# Altium schematic sheet Carte_Alim_2019_TOP.SchDoc
size A4; Author: Audran; CompanyName: Goldorak; Address1: Electrolab; Address2: 52 rue Paul Lescop; Address3: 92000 Nanterre; DocumentNumber: 1; SheetNumber: 1; SheetTotal: 5; ProjectName: Cartes_2017
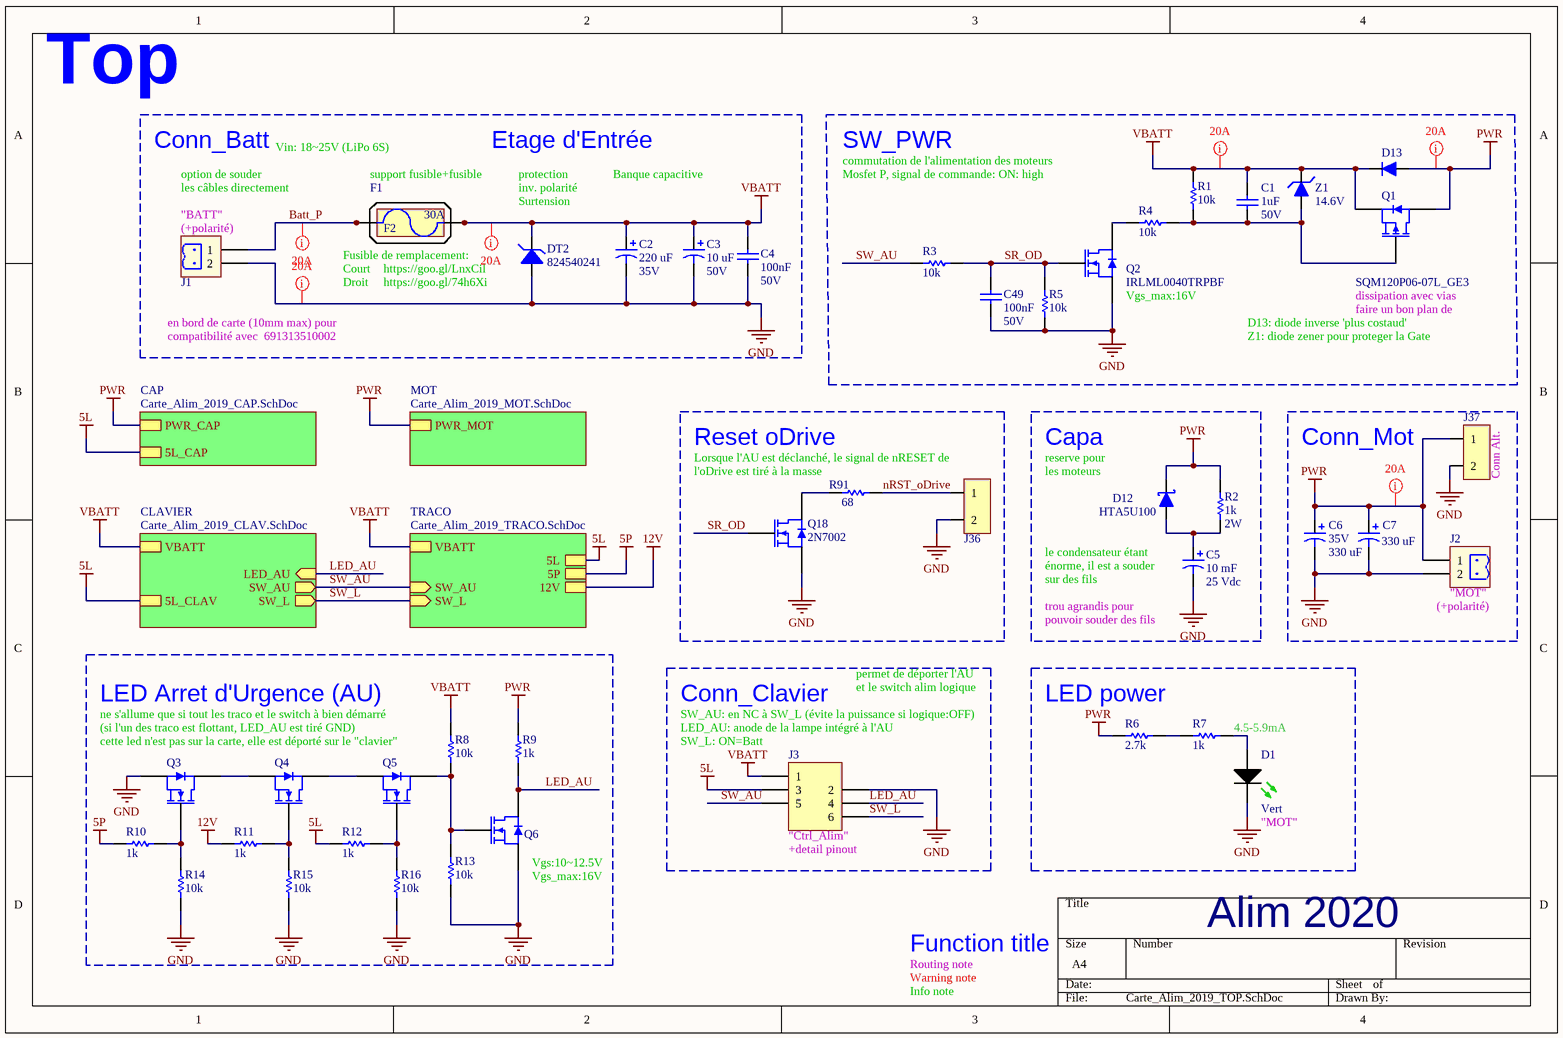
[diagram p0: Carte_Alim_2019_TOP.SchDoc]

## Parts
C1  1uF  RatedVoltage: 50V  [WCAP-CSGP_0805, 2x1.25x1.25]
C2  220 uF  RatedVoltage: 35V  [WCAP-ATG8_8x11.5x3.5x0.5]
C3  10 uF  RatedVoltage: 50V  [WCAP-ATG8_5x11x2x0.5]
C4  100nF  RatedVoltage: 50V  [WCAP-CSGP_0603, 1.6x0.8x0.8]
C5  10 mF  Rated Voltage: 25 Vdc  [WCAP-ATG8_22x41x10x0.8]
C6  330 uF  RatedVoltage: 35V  [WCAP-ATG8_10x12.5x5x0.6]
C7  330 uF  [WCAP-ATG8_10x12.5x5x0.6]
C49  100nF  RatedVoltage: 50V  [WCAP-CSGP_0603, 1.6x0.8x0.8]
D1  Vert  [SMCW_0603]
D12  HTA5U100  [SMA Diode (DO-214AC)]
D13  RS3J R6  [DO-214AB_Unidirectional]  (value not drawn)
DT2  824540241  [DO-214AB_Unidirectional]
F1  3557-2  [3557-2]  (value not drawn)
F2  Courant nominal: 30A  (hidden comment: 0891030.NXS)  (mechanical)
J1  691311500102  [691311500102]  (value not drawn)
J2  691311500102  [691311500102]  (value not drawn)
J3  690367280676  [690367280676]  (value not drawn)
J36  22-03-2021  [22-03-2021]  (value not drawn)
J37  22-03-2021  [22-03-2021]  (value not drawn)
Q1  SQM120P06-07L_GE3  [TO-263]
Q2  IRLML0040TRPBF  [SOT-23]
Q3  IRLML0040TRPBF  [SOT-23]  (value not drawn)
Q4  IRLML0040TRPBF  [SOT-23]  (value not drawn)
Q5  IRLML0040TRPBF  [SOT-23]  (value not drawn)
Q6  IRLML0040TRPBF  [SOT-23]  (value not drawn)
Q18  2N7002  [SOT-23]
R1  value 10k  [RESC1608X06N]  (hidden comment: RC0603FR-0710KL)
R2  1k  Power: 2W  [RESADV480W80L1200D390]
R3  value 10k  [RESC1608X06N]  (hidden comment: RC0603FR-0710KL)
R4  value 10k  [RESC1608X06N]  (hidden comment: RC0603FR-0710KL)
R5  value 10k  [RESC1608X06N]  (hidden comment: RC0603FR-0710KL)
R6  value 2.7k  [RESC2012X06M]  (hidden comment: RC0805FR-072K7L)
R7  value 1k  [RESC1608X06N]  (hidden comment: RC0603FR-071KL)
R8  value 10k  [RESC1608X06N]  (hidden comment: RC0603FR-0710KL)
R9  value 1k  [RESC1608X06N]  (hidden comment: RC0603FR-071KL)
R10  value 1k  [RESC1608X06N]  (hidden comment: RC0603FR-071KL)
R11  value 1k  [RESC1608X06N]  (hidden comment: RC0603FR-071KL)
R12  value 1k  [RESC1608X06N]  (hidden comment: RC0603FR-071KL)
R13  value 10k  [RESC1608X06N]  (hidden comment: RC0603FR-0710KL)
R14  value 10k  [RESC1608X06N]  (hidden comment: RC0603FR-0710KL)
R15  value 10k  [RESC1608X06N]  (hidden comment: RC0603FR-0710KL)
R16  value 10k  [RESC1608X06N]  (hidden comment: RC0603FR-0710KL)
R91  value 68  [RESC1608X06N]  (hidden comment: RC0603FR-0768RL)
Z1  value 14.6V  [SOD-323]  (hidden comment: MM3Z15VST1G)

## Blocks framed on the sheet
SW_PWR: C1 C49 D13 Q1 Q2 R1 R3-R5 Z1
Reset oDrive: J36 Q18 R91
Capa: C5 D12 R2
Conn_Mot: C6 C7 J2 J37
LED Arret d'Urgence (AU): Q3-Q6 R8-R16
Conn_Clavier: J3
LED power: D1 R6 R7

## Sub-sheets
CAP = Carte_Alim_2019_CAP.SchDoc: PWR_CAP, 5L_CAP
CLAVIER = Carte_Alim_2019_CLAV.SchDoc: 5L_CLAV, VBATT, SW_L (out), LED_AU (in), SW_AU (out)
MOT = Carte_Alim_2019_MOT.SchDoc: PWR_MOT
TRACO = Carte_Alim_2019_TRACO.SchDoc: VBATT, 5L, 5P, 12V, SW_L (in), SW_AU (in)

## Nets
5L: J3.3 R12.2 ; sheet CAP/5L_CAP, sheet TRACO/5L, sheet CLAVIER/5L_CLAV
5P: R10.2 ; sheet TRACO/5P
12V: R11.2 ; sheet TRACO/12V
GND: C2.2 C3.2 C4.1 C5.2 C6.2 C7.2 C49.1 D1.1(C) DT2.1 J1.2 J2.2 J3.2 J36.2 J37.2 Q2.2(S) Q3.2(S) Q6.2(S) Q18.2(S) R5.2 R13.1 R14.1 R15.1 R16.1
PWR: C6.1 C7.1 D12.2 D13.1 J2.1 J37.1 Q1.4(D) R2.1 R6.1 R9.2 ; sheet CAP/PWR_CAP, sheet MOT/PWR_MOT
VBATT: C1.2 C2.1 C3.1 C4.2 D13.2 DT2.2 F1.2 F1.4 J3.1 Q1.3(S) R1.2 R8.2 Z1.2 ; sheet TRACO/VBATT, sheet CLAVIER/VBATT
Batt_P: F1.1 F1.3 J1.1
LED_AU: J3.4 Q6.3(D) R9.1 ; sheet CLAVIER/LED_AU
nRST_oDrive: J36.1 R91.2
SR_OD: C49.2 Q2.1(G) Q18.1(G) R3.2 R5.1
SW_AU: J3.5 R3.1 ; sheet TRACO/SW_AU, sheet CLAVIER/SW_AU
SW_L: J3.6 ; sheet TRACO/SW_L, sheet CLAVIER/SW_L
NetC1_1: C1.1 Q1.1(G) R1.1 R4.1 Z1.1
NetC5_1: C5.1 D12.1 R2.2
NetD1_2: D1.2(A) R7.1
NetQ2_3: Q2.3(D) R4.2
NetQ3_1: Q3.1(G) R10.1 R14.2
NetQ3_3: Q3.3(D) Q4.2(S)
NetQ4_1: Q4.1(G) R11.1 R15.2
NetQ4_3: Q4.3(D) Q5.2(S)
NetQ5_1: Q5.1(G) R12.1 R16.2
NetQ5_3: Q5.3(D) Q6.1(G) R8.1 R13.2
NetQ18_3: Q18.3(D) R91.1
NetR6_2: R6.2 R7.2

## Layout directives
net class PWR_20A: Batt_P, GND, PWR, VBATT

## Notes on the sheet
- Top
- Conn_Batt
- option de souder
- Vin: 18~25V (LiPo 6S)
- support fusible+fusible
- Etage d'Entrée
- protection
- Banque capacitive
- commutation de l'alimentation des moteurs
- Mosfet P, signal de commande: ON: high
- les câbles directement
- (near J1) "BATT"
- (near J1) (+polarité)
- inv. polarité
- Surtension
- Droit
- Court
- Fusible de remplacement:
- (near DT2) https://goo.gl/74h6Xi
- (near DT2) https://goo.gl/LnxCil
- (near Q2) Vgs_max:16V
- faire un bon plan de
- dissipation avec vias
- compatibilité avec  691313510002
- en bord de carte (10mm max) pour
- D13: diode inverse 'plus costaud'
- Z1: diode zener pour proteger la Gate
- Lorsque l'AU est déclanché, le signal de nRESET de
- (near R91) l'oDrive est tiré à la masse
- reserve pour
- les moteurs
- (near J37) Conn Alt.
- (near C5) le condensateur étant
- (near C5) énorme, il est a souder
- sur des fils
- (near C5) trou agrandis pour
- (near C5) pouvoir souder des fils
- (near J2) (+polarité)
- (near J2) "MOT"
- (near R8) ne s'allume que si tout les traco et le switch à bien démarré
- SW_AU: en NC à SW_L (évite la puissance si logique:OFF)
- permet de déporter l'AU
- et le switch alim logique
- (si l'un des traco est flottant, LED_AU est tiré GND)
- (near R8) cette led n'est pas sur la carte, elle est déporté sur le "clavier"
- (near J3) LED_AU: anode de la lampe intégré à l'AU
- (near J3) SW_L: ON=Batt
- (near R7) 4.5-5.9mA
- (near J3) "Ctrl_Alim"
- (near J3) +detail pinout
- (near D1) "MOT"
- (near Q6) Vgs_max:16V
- (near Q6) Vgs:10~12.5V
- Routing note
- Warning note
- Function title
- Alim 2020
- Info note

## Library data of the parts
C1 = WCAP-CSGP, 885012207103: CAP CER 1uF 50V X7R 0805; Manufacturer: Wurth Elektronik; PublishedDate: Aug 2016; ComponentLink1Description: Manufacturer; ComponentLink1URL: http://www.we-online.de; ComponentLink2Description: Datasheet; ComponentLink2URL: http://katalog.we-online.com/pbs/datasheet/885012207103.pdf; Manufacturer Part Number: 885012207103; Value: 1uF; Size: 0805; CeramicType: X7R
C2 = WCAP-ATG8, 860010574011: CAP Alu 220 UF 20% 35 V; Manufacturer: Wurth Elektronik; PublishedDate: July 2016; ComponentLink1Description: Manufacturer; ComponentLink1URL: http://www.we-online.de; ComponentLink2Description: Datasheet; ComponentLink2URL: http://katalog.we-online.de/pbs/datasheet/860010574011.pdf; Manufacturer Part Number: 860010574011; Value: 220 uF; Size: 8mmx11.5mm
C3 = WCAP-ATG8, 860010672009: CAP Alu 10 UF 20% 50 V; Manufacturer: Wurth Elektronik; PublishedDate: July 2016; ComponentLink1Description: Manufacturer; ComponentLink1URL: http://www.we-online.de; ComponentLink2Description: Datasheet; ComponentLink2URL: http://katalog.we-online.de/pbs/datasheet/860010672009.pdf; Value: 10 uF; Size: 5mmx11mm; Manufacturer Part Number: 860010672009
C4 C49 = WCAP-CSGP, 885012206095: CAP CER 100nF 50V X7R 0603; Manufacturer: Wurth Elektronik; PublishedDate: Aug 2016; ComponentLink1Description: Manufacturer; ComponentLink1URL: http://www.we-online.de; ComponentLink2Description: Datasheet; ComponentLink2URL: http://katalog.we-online.com/pbs/datasheet/885012206095.pdf; Value: 100nF; Size: 0603; CeramicType: X7R; Manufacturer Part Number: 885012206095
C5 = WCAP-ATG8, 860010483029: CAP Alu 10'000 UF 25 V; Manufacturer: Wurth Elektronik; ComponentLink1Description: Manufacturer; ComponentLink1URL: http://www.we-online.de; ComponentLink2Description: Datasheet; ComponentLink2URL: http://katalog.we-online.de/pbs/datasheet/860010483029.pdf; Manufacturer Part Number: 860010483029; Published Date: Sep. 2017; Size: 22x41mm; Value: 10 mF
C6 = WCAP-ATG8, 860010575012: CAP Alu 330 UF 20% 35 V; Manufacturer: Wurth Elektronik; PublishedDate: July 2016; ComponentLink1Description: Manufacturer; ComponentLink1URL: http://www.we-online.de; ComponentLink2Description: Datasheet; ComponentLink2URL: http://katalog.we-online.de/pbs/datasheet/860010575012.pdf; Manufacturer Part Number: 860010575012; Value: 330 uF; Size: 10mmx12.5mm
C7 = WCAP-ATG8, 860010575012: CAP Alu 330 UF 20% 35 V; Manufacturer: Wurth Elektronik; RatedVoltage: 35V; PublishedDate: July 2016; ComponentLink1Description: Manufacturer; ComponentLink1URL: http://www.we-online.de; ComponentLink2Description: Datasheet; ComponentLink2URL: http://katalog.we-online.de/pbs/datasheet/860010575012.pdf; Manufacturer Part Number: 860010575012; Value: 330 uF; Size: 10mmx12.5mm
D1 = WL-SMCW 0603  150060GS75000: SMD mono-color Chip LED, WL-SMCW, Green; Manufacturer 1: Würth Elektronik eiSos GmbH; Manufacturer Part Number: 150060GS75000; ComponentLink1Description: Manufacturer; ComponentLink1URL: http://www.we-online.de; Created by: Christin Otto; Created Date: June 2013; ComponentLink2Description: Datasheet; ComponentLink2URL: http://katalog.we-online.com/led/datasheet/150060GS75000.pdf; Color: Green; Value: Vert; Supplier 1: Farnell; Supplier Part Number 1: 2322070
D12 = HTA5U100: DIODE SCHOTTKY 100V 5A SMA (DO-214AC); Manufacturer: MULTICOMP; ContinuousForwardCurrent: 5A (Pk 50A); Supplier 1: Farnell; Manufacturer Part Number: HTA5U100; ComponentLink1Description: Manufacturer; Supplier Part Number 1: 2750942; ComponentLink2Description: Datasheet; ComponentLink2URL: http://www.farnell.com/datasheets/2282884.pdf; ReverseVoltage: 100V; Type: Schottky
D13 = RS3J_R6: DIODE GEN PURP 600V 3A SMC; Manufacturer: TAIWAN SEMICONDUCTOR; Type: Standard; Manufacturer Part Number: RS3J R6; ComponentLink2Description: Datasheet; ComponentLink2URL: http://www.farnell.com/datasheets/2182655.pdf; ContinuousForwardCurrent: 3A; ReverseVoltage: 600V; Supplier 1: Farnell; Supplier Part Number 1: 2677388
DT2 = 824540241: WE-TVSP Power TVS Diode, Unidirectional, 1500 W, 24 VDC; Manufacturer: Wurth Electronics Inc.; Supplier 1: Farnell; Supplier Part Number 1: 2536699; Manufacturer Part Number: 824540241; ComponentLink1URL: http://katalog.we-online.de/pbs/datasheet/824540241.pdf; ComponentLink1Description: Datasheet
F1 = 3557-2: FUSE Holder 500V 30A PCB; Manufacturer: Keystone Electronics; Supplier 1: Farnell; Supplier Part Number 1: 2292904; Manufacturer Part Number: 3557-2; ComponentLink1URL: http://www.keyelco.com/product-pdf.cfm?p=296; ComponentLink1Description: Datasheet; Courant nominal: 30A
F2 = 0891030.NXS: FUSE AUTO 30A 58VDC BLADE MINI; Manufacturer: Littelfuse Inc.; Manufacturer Part Number: 0891030.NXS; Supplier 1: Digi-Key; Supplier Part Number 1: F4993-ND; ComponentLink1URL: http://www.littelfuse.com/~/media/automotive/datasheets/fuses/passenger-car-and-commercial-vehicle/blade-fuses/littelfuse_lowprofilemini_datasheet.pdf; ComponentLink1Description: Datasheet
J1 J2 = 691311500102: WR-TBL 2p Series 311 - 5.08 mm Closed Vertical PCB Header; Manufacturer: Wurth Electronics Inc.; Value: 2; Manufacturer Part Number: 691311500102; ComponentLink1Description: Datasheet; ComponentLink1URL: https://katalog.we-online.de/em/datasheet/6913115001xx.pdf; Supplier 1: Farnell; Supplier Part Number 1: 1641978
J3 = 690367280676: WR-MM 6p Female SMT Connector with Polarization; Manufacturer: Wurth Electronics Inc.; Value: 6; ComponentLink1Description: Datasheet; ComponentLink1URL: http://katalog.we-online.de/em/datasheet/69036728xx76.pdf; Manufacturer Part Number: 690367280676; Supplier 1: Farnell; Supplier Part Number 1: 1641849
J36 J37 = 22-03-2021: Manufacturer 1: MOLEX; Supplier 1: Farnell; Supplier Part Number 1: 9731075; Manufacturer Part Number: 22-03-2021; Pricing: 10=0.189, 100=0.147, 200=0.119, 500=0.108, 1000=0.088, 2500=0.08, 2500=0.0711, 20000=0.064 (EUR); ComponentLink1URL: http://www.farnell.com/cad/1533907.pdf; ComponentLink1Description: http://www.farnell.com/cad/1533907.pdf; ComponentLink2URL: http://www.farnell.com/datasheets/1791308.pdf; ComponentLink2Description: http://www.farnell.com/datasheets/1791308.pdf
Q1 = SQM120P06-07L_GE3: MOSFET P 60V 120A D2PAK; Manufacturer: VISHAY; Supplier 1: Farnell; Supplier Part Number 1: 2617099; Manufacturer Part Number: SQM120P06-07L_GE3; ComponentLink1Description: Datasheet; ComponentLink1URL: http://www.vishay.com/docs/67026/sqm120p0.pdf
Q2-Q6 = IRLML0040: MOSFET N 40V 3.6A SOT23; Manufacturer: INTERNATIONAL RECTIFIER; Supplier 1: Farnell; Supplier Part Number 1: 1831088; Manufacturer Part Number: IRLML0040TRPBF; ComponentLink1Description: http://www.irf.com/product-info/datasheets/data/irlml0040pbf.pdf; ComponentLink1URL: http://www.irf.com/product-info/datasheets/data/irlml0040pbf.pdf
Q18 = 2N7002: MOSFET N 60V 115MA SOT-23; Manufacturer: Changjiang Electronics Tech (CJ); Manufacturer Part Number: 2N7002; ComponentLink1Description: Datasheet; ComponentLink1URL: https://datasheet.lcsc.com/szlcsc/1810151612_Changjiang-Electronics-Tech-CJ-2N7002_C8545.pdf; Supplier 2: JLCPCB; Supplier Part Number 2: C8545; Supplier 1: Farnell; Supplier Part Number 1: 1510761
R1 R3-R5 R8 R13-R16 = RC0603FR-0710KL: RES SMD 10K OHM 1% 1/10W 0603; Manufacturer: Yageo; Power: 100mW; Vmax: 50V; Manufacturer Part Number: RC0603FR-0710KL; Type: Thick Film; ComponentLink1Description: Manufacturer; ComponentLink1URL: http://www.yageo.com/NewPortal/_en/index.jsp; ComponentLink2Description: Datasheet; ComponentLink2URL: http://www.farnell.com/datasheets/2167052.pdf; Supplier 1: Farnell; Supplier Part Number 1: 9238603; Precision: ±1%
R2 = Generic_TH_Vert_Res: resistance traversante verticale générique; Manufacturer: MULTICOMP; Manufacturer Part Number: MCKNP02WJ0102A19; Precision: ±5%; Type: Through Hole; Supplier 1: Farnell; Supplier Part Number 1: 1903754; Value: 1k
R6 = RC0805FR-072K7L: RES SMD 2K7 OHM 1% 1/8W 0805; Manufacturer: Yageo; Power: 125mW; Vmax: 50V; Manufacturer Part Number: RC0805FR-072K7L; Type: Thick Film; ComponentLink1Description: Manufacturer; ComponentLink1URL: http://www.yageo.com/NewPortal/_en/index.jsp; ComponentLink2Description: Datasheet; ComponentLink2URL: http://www.farnell.com/datasheets/444164.pdf; Supplier 1: Farnell; Supplier Part Number 1: 9237666; Precision: ±1%
R7 R9-R12 = RC0603FR-071KL: RES SMD 1K OHM 1% 1/10W 0603; Manufacturer: Yageo; Power: 100mW; Vmax: 50V; Manufacturer Part Number: RC0603FR-071KL; Type: Thick Film; ComponentLink1Description: Manufacturer; ComponentLink1URL: http://www.yageo.com/NewPortal/_en/index.jsp; ComponentLink2Description: Datasheet; ComponentLink2URL: http://www.farnell.com/datasheets/2167052.pdf; Precision: ±1%; Supplier 1: Farnell; Supplier Part Number 1: 9238484
R91 = RC0603FR-0768RL: RES SMD 68 OHM 1% 1/10W 0603; Manufacturer: Yageo; Power: 100mW; Vmax: 50V; Manufacturer Part Number: RC0603FR-0768RL; Type: Thick Film; ComponentLink1Description: Manufacturer; ComponentLink1URL: http://www.yageo.com/NewPortal/_en/index.jsp; ComponentLink2Description: Datasheet; ComponentLink2URL: http://www.farnell.com/datasheets/1868787.pdf; Supplier 1: Farnell; Supplier Part Number 1: 9238344; Precision: ±1%
Z1 = MM3Z15VST1G: DIODE ZENER 14.6V 300mW SOD323; Manufacturer: ON Semiconductor; Manufacturer Part Number: MM3Z15VST1G; ComponentLink1URL: http://www.farnell.com/datasheets/2028649.pdf; ComponentLink1Description: Datasheet; Supplier 1: Farnell; Supplier Part Number 1: 2533369